# Altium schematic sheet SPI_Extender.SchDoc: RFSOC SAWG
size 420 x 297 mm; Author: G.Kasprowicz; CompanyName: WUT ISE; DrawnBy: G.Kasprowicz; Organization: WUT ISE; Address1: PW ISE; Address2: Nowowiejska 15/19 00-665 Warsaw; Address3: gkasprow@gmail.com; DocumentNumber: 20; Revision: 1; SheetNumber: 20; SheetTotal: 20; ModifiedBy: -; CheckedDate: -; Title2: SPI Extender; DivGrp: WUT ISE; Designer: G.Kasprowicz; ModifiedDate: -; ProjectName: Sensor Box
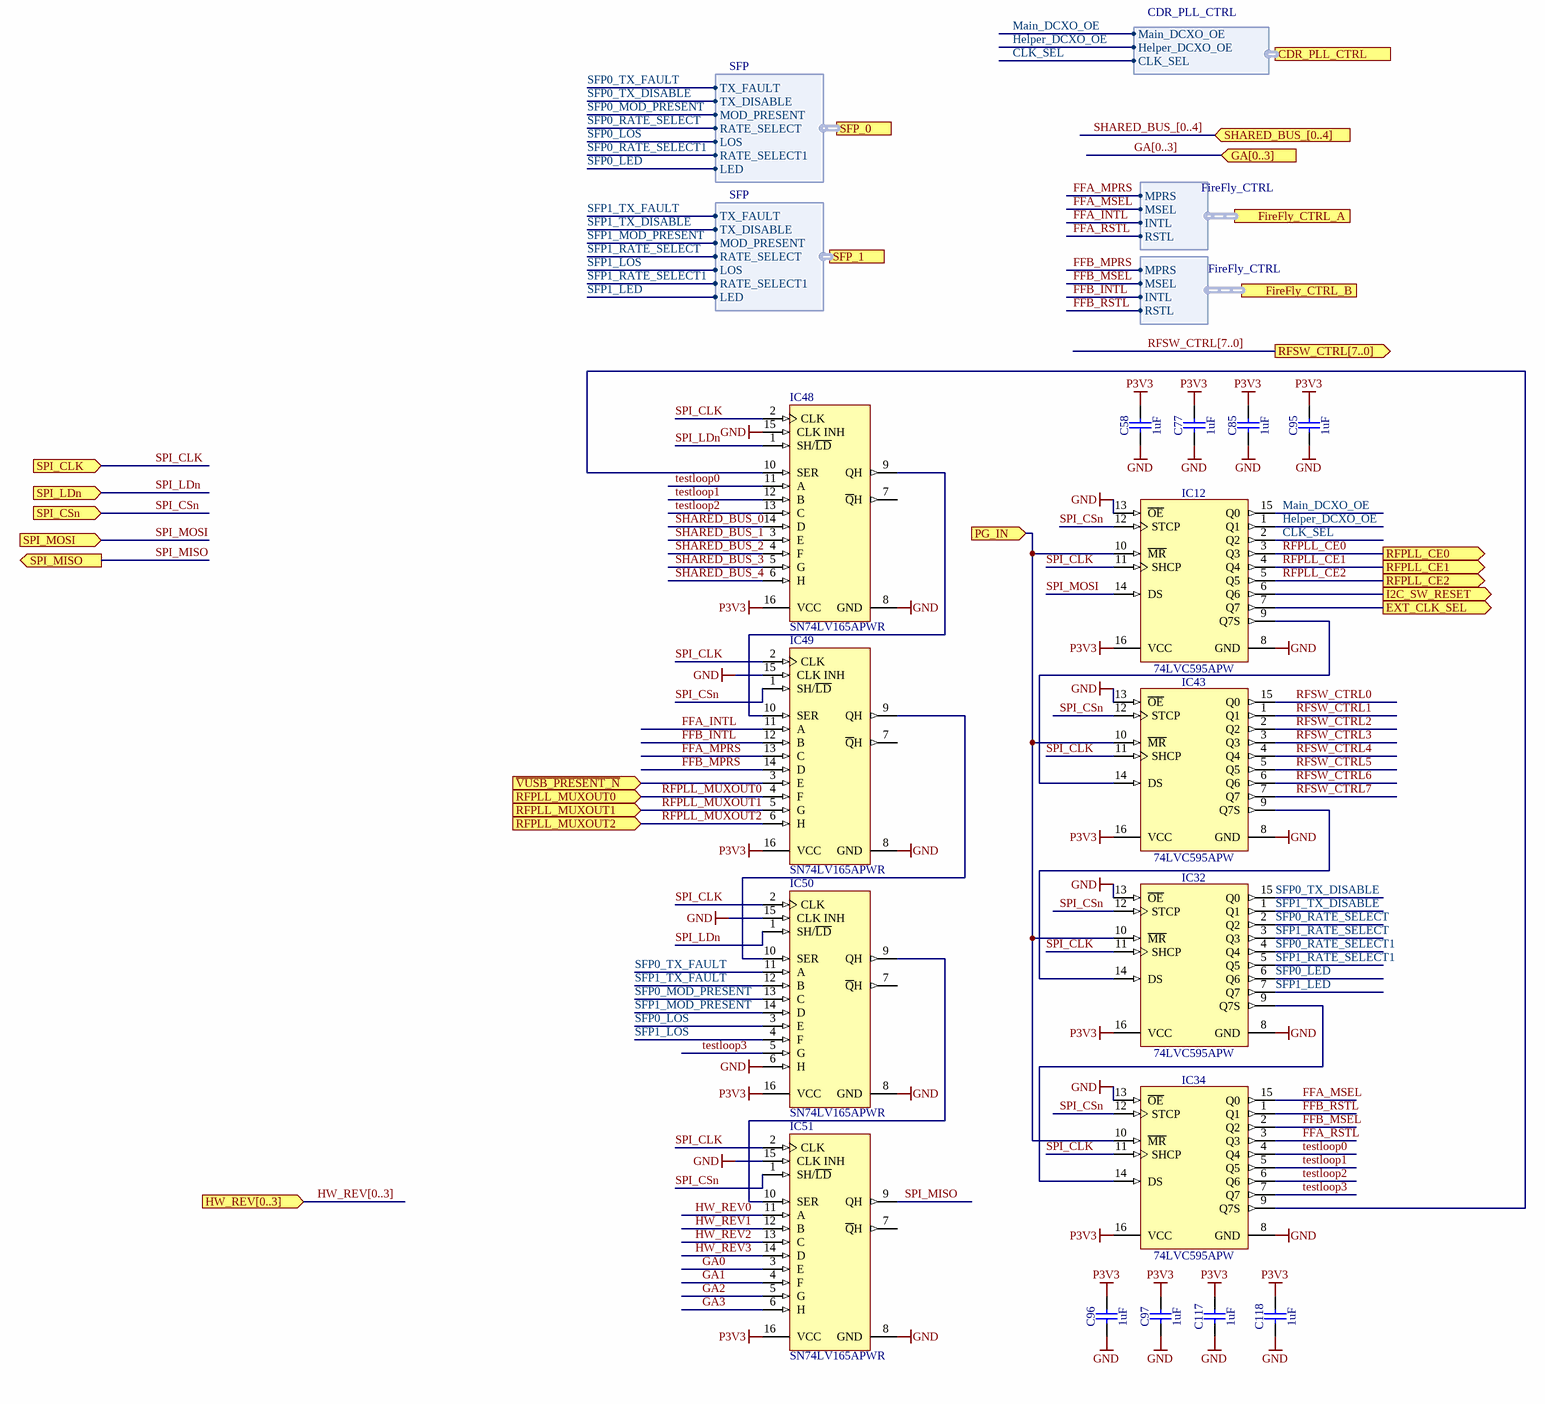
[diagram p0: SPI_Extender.SchDoc]

## Parts
C58  1uF  [CAPC1608X87N]
C77  1uF  [CAPC1608X87N]
C85  1uF  [CAPC1608X87N]
C95  1uF  [CAPC1608X87N]
C96  1uF  [CAPC1608X87N]
C97  1uF  [CAPC1608X87N]
C117  1uF  [CAPC1608X87N]
C118  1uF  [CAPC1608X87N]
IC12  74LVC595APW  [SOP65P640X110-16N]
IC32  74LVC595APW  [SOP65P640X110-16N]
IC34  74LVC595APW  [SOP65P640X110-16N]
IC43  74LVC595APW  [SOP65P640X110-16N]
IC48  SN74LV165APWR  [PW0016A_M]
IC49  SN74LV165APWR  [PW0016A_M]
IC50  SN74LV165APWR  [PW0016A_M]
IC51  SN74LV165APWR  [PW0016A_M]

## Ports
CDR_PLL_CTRL (harness CDR_PLL_CTRL), EXT_CLK_SEL (out), FireFly_CTRL_A (harness FireFly_CTRL), FireFly_CTRL_B (harness FireFly_CTRL), GA[0..3] (in), HW_REV[0..3] (in), I2C_SW_RESET (out), PG_IN (in), RFPLL_CE0 (out), RFPLL_CE1 (out), RFPLL_CE2 (out), RFPLL_MUXOUT0 (in), RFPLL_MUXOUT1 (in), RFPLL_MUXOUT2 (in), RFSW_CTRL[7..0] (out), SFP_0 (harness SFP), SFP_1 (harness SFP), SHARED_BUS_[0..4] (in), SPI_CLK (in), SPI_CSn (in), SPI_LDn (in), SPI_MISO (out), SPI_MOSI (in), ~{VUSB_PRESENT_N} (in)

## Harnesses
FireFly_CTRL: MPRS, MSEL, INTL, RSTL
CDR_PLL_CTRL: Main_DCXO_OE, Helper_DCXO_OE, CLK_SEL
SFP: TX_FAULT, LOS, MOD_PRESENT, TX_DISABLE, RATE_SELECT, LED, RATE_SELECT1

## Nets
GND: C58.1 C77.1 C85.1 C95.1 C96.1 C97.1 C117.1 C118.1 IC12.8(GND) IC12.13(~{OE}) IC32.8(GND) IC32.13(~{OE}) IC34.8(GND) IC34.13(~{OE}) IC43.8(GND) IC43.13(~{OE}) IC48.8(GND) IC48.15(CLK_INH) IC49.8(GND) IC49.15(CLK_INH) IC50.6(H) IC50.8(GND) IC50.15(CLK_INH) IC51.8(GND) IC51.15(CLK_INH)
P3V3: C58.2 C77.2 C85.2 C95.2 C96.2 C97.2 C117.2 C118.2 IC12.16(VCC) IC32.16(VCC) IC34.16(VCC) IC43.16(VCC) IC48.16(VCC) IC49.16(VCC) IC50.16(VCC) IC51.16(VCC)
~{VUSB_PRESENT_N}: IC49.3(E) ; port ~{VUSB_PRESENT_N}
CLK_SEL: IC12.2(Q2) ; port CDR_PLL_CTRL.CLK_SEL
EXT_CLK_SEL: IC12.7(Q7) ; port EXT_CLK_SEL
FFA_INTL: IC49.11(A) ; port FireFly_CTRL_A.INTL
FFA_MPRS: IC49.13(C) ; port FireFly_CTRL_A.MPRS
FFA_MSEL: IC34.15(Q0) ; port FireFly_CTRL_A.MSEL
FFA_RSTL: IC34.3(Q3) ; port FireFly_CTRL_A.RSTL
FFB_INTL: IC49.12(B) ; port FireFly_CTRL_B.INTL
FFB_MPRS: IC49.14(D) ; port FireFly_CTRL_B.MPRS
FFB_MSEL: IC34.2(Q2) ; port FireFly_CTRL_B.MSEL
FFB_RSTL: IC34.1(Q1) ; port FireFly_CTRL_B.RSTL
GA0: IC51.3(E)
GA1: IC51.4(F)
GA2: IC51.5(G)
GA3: IC51.6(H)
Helper_DCXO_OE: IC12.1(Q1) ; port CDR_PLL_CTRL.Helper_DCXO_OE
HW_REV0: IC51.11(A)
HW_REV1: IC51.12(B)
HW_REV2: IC51.13(C)
HW_REV3: IC51.14(D)
I2C_SW_RESET: IC12.6(Q6) ; port I2C_SW_RESET
Main_DCXO_OE: IC12.15(Q0) ; port CDR_PLL_CTRL.Main_DCXO_OE
PG_IN: IC12.10(~{MR}) IC32.10(~{MR}) IC34.10(~{MR}) IC43.10(~{MR}) ; port PG_IN
RFPLL_CE0: IC12.3(Q3) ; port RFPLL_CE0
RFPLL_CE1: IC12.4(Q4) ; port RFPLL_CE1
RFPLL_CE2: IC12.5(Q5) ; port RFPLL_CE2
RFPLL_MUXOUT0: IC49.4(F) ; port RFPLL_MUXOUT0
RFPLL_MUXOUT1: IC49.5(G) ; port RFPLL_MUXOUT1
RFPLL_MUXOUT2: IC49.6(H) ; port RFPLL_MUXOUT2
RFSW_CTRL0: IC43.15(Q0)
RFSW_CTRL1: IC43.1(Q1)
RFSW_CTRL2: IC43.2(Q2)
RFSW_CTRL3: IC43.3(Q3)
RFSW_CTRL4: IC43.4(Q4)
RFSW_CTRL5: IC43.5(Q5)
RFSW_CTRL6: IC43.6(Q6)
RFSW_CTRL7: IC43.7(Q7)
SFP0_LED: IC32.6(Q6) ; port SFP_0.LED
SFP0_LOS: IC50.3(E) ; port SFP_0.LOS
SFP0_MOD_PRESENT: IC50.13(C) ; port SFP_0.MOD_PRESENT
SFP0_RATE_SELECT: IC32.2(Q2) ; port SFP_0.RATE_SELECT
SFP0_RATE_SELECT1: IC32.4(Q4) ; port SFP_0.RATE_SELECT1
SFP0_TX_DISABLE: IC32.15(Q0) ; port SFP_0.TX_DISABLE
SFP0_TX_FAULT: IC50.11(A) ; port SFP_0.TX_FAULT
SFP1_LED: IC32.7(Q7) ; port SFP_1.LED
SFP1_LOS: IC50.4(F) ; port SFP_1.LOS
SFP1_MOD_PRESENT: IC50.14(D) ; port SFP_1.MOD_PRESENT
SFP1_RATE_SELECT: IC32.3(Q3) ; port SFP_1.RATE_SELECT
SFP1_RATE_SELECT1: IC32.5(Q5) ; port SFP_1.RATE_SELECT1
SFP1_TX_DISABLE: IC32.1(Q1) ; port SFP_1.TX_DISABLE
SFP1_TX_FAULT: IC50.12(B) ; port SFP_1.TX_FAULT
SHARED_BUS_0: IC48.14(D)
SHARED_BUS_1: IC48.3(E)
SHARED_BUS_2: IC48.4(F)
SHARED_BUS_3: IC48.5(G)
SHARED_BUS_4: IC48.6(H)
SPI_CLK: IC12.11(SHCP) IC32.11(SHCP) IC34.11(SHCP) IC43.11(SHCP) IC48.2(CLK) IC49.2(CLK) IC50.2(CLK) IC51.2(CLK) ; port SPI_CLK
SPI_CSn: IC12.12(STCP) IC32.12(STCP) IC34.12(STCP) IC43.12(STCP) IC49.1(SH/~{LD}) IC51.1(SH/~{LD}) ; port SPI_CSn
SPI_LDn: IC48.1(SH/~{LD}) IC50.1(SH/~{LD}) ; port SPI_LDn
SPI_MISO: IC51.9(QH) ; port SPI_MISO
SPI_MOSI: IC12.14(DS) ; port SPI_MOSI
testloop0: IC34.4(Q4) IC48.11(A)
testloop1: IC34.5(Q5) IC48.12(B)
testloop2: IC34.6(Q6) IC48.13(C)
testloop3: IC34.7(Q7) IC50.5(G)
NetIC12_9: IC12.9(Q7S) IC43.14(DS)
NetIC32_9: IC32.9(Q7S) IC34.14(DS)
NetIC32_14: IC32.14(DS) IC43.9(Q7S)
NetIC34_9: IC34.9(Q7S) IC48.10(SER)
NetIC48_9: IC48.9(QH) IC49.10(SER)
NetIC49_9: IC49.9(QH) IC50.10(SER)
NetIC50_9: IC50.9(QH) IC51.10(SER)

Not connected (* = marked no-connect by the designer): IC48 7(~{Q}H); IC49 7(~{Q}H); IC50 7(~{Q}H); IC51 7(~{Q}H)

## Buses and harness runs
bus GA[0..3] = port GA[0..3]
bus HW_REV[0..3] = port HW_REV[0..3]
bus RFSW_CTRL[7..0] = port RFSW_CTRL[7..0]
bus SHARED_BUS_[0..4] = port SHARED_BUS_[0..4]

## Notes on the sheet
- Project/Equipment
- Document
- Designer
- Drawn by
- Check.by
- Copyright WUT ISE 2020.
  This documentation describes Open Hardware and is licensed under the CERN OHL v.1.2. You may redistribute and modify this documentation under the terms of the CERN OHL v.1.2. (http://ohwr.org/CERNOHL). This documentation is distributed WITHOUT ANY EXPRESS OR IMPLIED WARRANTY, INCLUDING OF MERCHANTABILITY, SATISFACTORY QUALITY AND FITNESS FOR A PARTICULAR PURPOSE. Please see the CERN OHL v.1.2 for applicable conditions.
- Contact
- File
- Last Mod.
- Print Date
- Sheet
- Size
- A3
- of
- Rev

## Library data of the parts
C58 C77 C85 C95-C97 C117 C118 = CC0603_1UF_25V_10%_X7R: Non-polarised capacitor; Part Description: SMD Multilayer Chip Ceramic Capacitor; Manufacturer: GENERIC; Manufacturer1 Part Number: GRM188R71E105KA12D; Voltage: 25V; TC: X7R; Tolerance: ±10%; Part Number: CC0603_1UF_25V_10%_X7R; Component Kind: Standard; Component Type: Standard; Pin Count: 2; Value: 1uF; Status: None; Manufacturer Part Number: CC0603_1UF_25V_10%_X7R; Case: 0603; Mounted: Yes; Socket: No; SMD: Yes; Sense: No; Manufacturer1 Example: MURATA; Manufacturer1 ComponentHeight: 0.9mm; HelpURL: \\cern.ch\dfs\Applications\Altium\Datasheets\CC0603_X7R_MURATA.pdf; Author: CERN DEM JLC; CreateDate: 18.01.2011; LatestRevisionDate: 18.01.2011
IC12 IC32 IC34 IC43 = 74LVC595APW: 8-Bit Shift Register With 3-State Output Register; Part Description: 8-Bit Shift Register with 3-State Output Registers; Manufacturer: NEXPERIA; PressFit: No; Bonding: No; Part Number: 74LVC595APW; Component Kind: Standard; Component Type: Standard; Device: 74LVC595APW; PackageDescription: SOP, 0.65mm Pitch; 16 Pin, 4.40mm W X 5.00mm L X 1.10mm H body, IPC Medium Density; Manufacturer Part Number: 74LVC595APW; Pin Count: 16; Case: TSSOP16; Mounted: Yes; Socket: No; SMD: Yes; Sense: No; ComponentHeight: 1.1mm; Author: CERN DEM HF; HelpURL: \\cern.ch\dfs\Applications\Altium\Datasheets\74LVC595APW.pdf; CreateDate: 11.04.2022; LatestRevisionDate: 11.04.2022
IC48-IC51 = CMP-0780-00191-3: Parallel-Load 8-Bit Shift Registers, PW0016A, LARGE T&R; Manufacturer: Texas Instruments; Bits: 8; No. of Outputs: 2; Voltage(Nom)(V): 2.5, 3.3, 5; 3-State Output: No; Input Type: CMOS; Output Drive (IOL/IOH)(Max)(mA): 50/-50; Technology Family: LV-A; ICC @ Nom Voltage(Max)(mA): 0.02; F @ Nom Voltage(Max)(Mhz): 70; VCC(Max)(V): 5.5; Rating: Catalog; tpd @ Nom Voltage(Max)(ns): 28, 16.9, 13.5; VCC(Min)(V): 2; DatasheetVersion: SCLS402N; Generic Part Number: SN74LV165A; Operating Temperature Range(C): -40 to 125; Output Type: CMOS; PackageVersion: http://www.ti.com/lit/ml/mpds361/mpds361.pdf; Code_JEDEC: MO-153; PackageReference: PW0016A